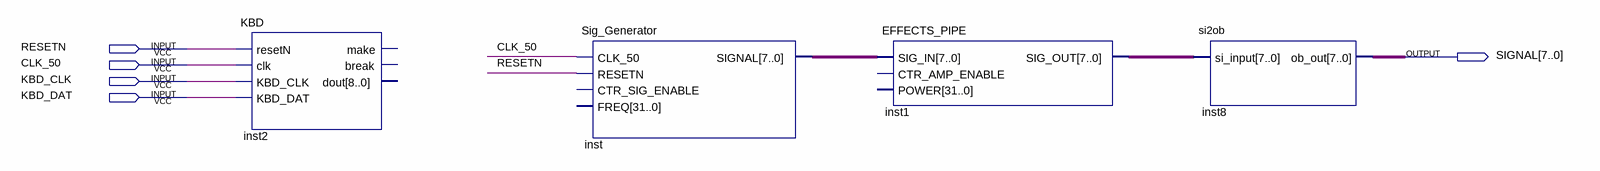
[diagram p0: schematic sheet]
// Quartus schematic DJ_TOP_ARCH.bdf as structural Verilog: 4 symbols, 5 pins
module DJ_TOP_ARCH (
  input  RESETN,
  input  CLK_50,
  input  KBD_CLK,
  input  KBD_DAT,
  output [7:0] SIGNAL
);

  wire [7:0] inst1_sig_out, inst_signal;

  KBD inst2 (.resetN(RESETN), .clk(CLK_50), .KBD_CLK(KBD_CLK), .KBD_DAT(KBD_DAT));  // open: make, break, dout
  Sig_Generator inst (.CLK_50(CLK_50), .RESETN(RESETN), .SIGNAL(inst_signal));  // open: CTR_SIG_ENABLE, FREQ
  EFFECTS_PIPE inst1 (.SIG_IN(inst_signal), .SIG_OUT(inst1_sig_out));  // open: CTR_AMP_ENABLE, POWER
  si2ob inst8 (.si_input(inst1_sig_out), .ob_out(SIGNAL));
endmodule
